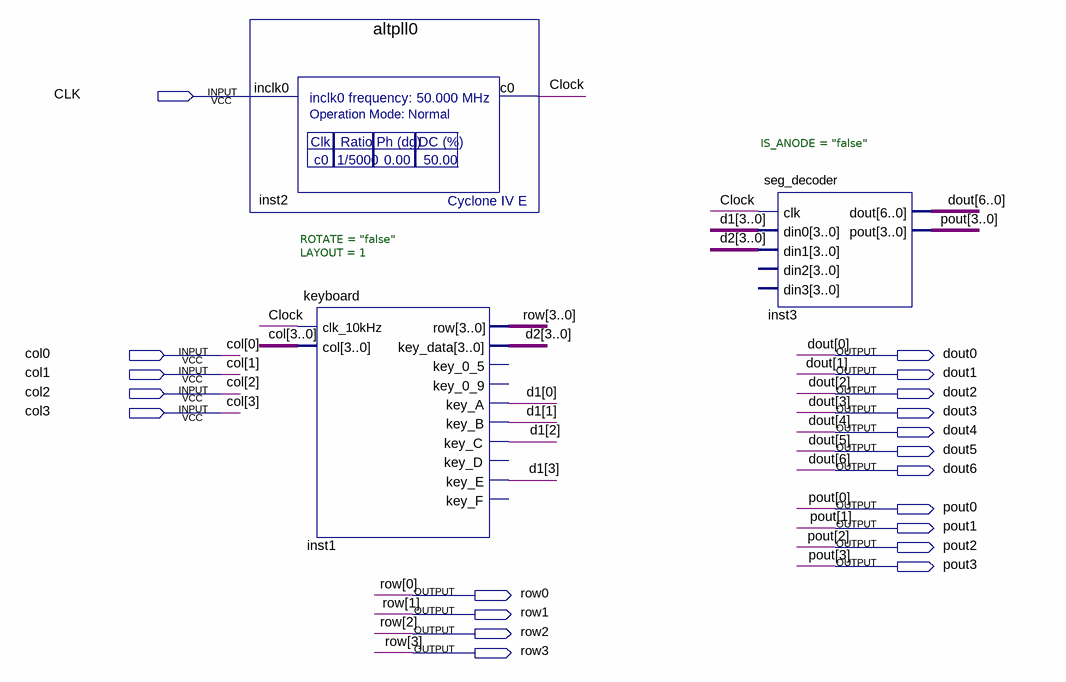
[diagram p0: schematic sheet]
// Quartus schematic DesignTest.bdf as structural Verilog: 3 symbols, 20 pins
module DesignTest (
  input  CLK,
  input  col0,
  input  col1,
  input  col2,
  input  col3,
  output dout0,
  output dout1,
  output dout2,
  output dout3,
  output dout4,
  output dout5,
  output dout6,
  output pout0,
  output pout1,
  output pout2,
  output pout3,
  output row0,
  output row1,
  output row2,
  output row3
);

  wire Clock;
  wire [3:0] d1, d2;

  altpll0 inst2 (.inclk0(CLK), .c0(Clock));
  keyboard #(.ROTATE("false"), .LAYOUT(1)) inst1 (
    .clk_10kHz(Clock), .col({col3, col2, col1, col0}), .row({row3, row2, row1, row0}), .key_data(d2),
    .key_A(d1[0]), .key_B(d1[1]), .key_C(d1[2]), .key_E(d1[3]));  // open: key_0_5, key_0_9, key_D, key_F
  seg_decoder #(.IS_ANODE("false")) inst3 (
    .clk(Clock), .din0(d1), .din1(d2), .dout({dout6, dout5, dout4, dout3, dout2, dout1, dout0}),
    .pout({pout3, pout2, pout1, pout0}));  // open: din2, din3
endmodule
